# Altium schematic sheet PSU_NCP630_ADJ.SchDoc: PSU NCP630A ADJ
size A4; Organization: Altium Limited.; Address1: Level 3, 12a Rodborough Rd; Address2: Frenchs Forest 2086; Address3: NSW; Address4: AUSTRALIA; DocumentNumber: 40; SheetNumber: 41; SheetTotal: 106
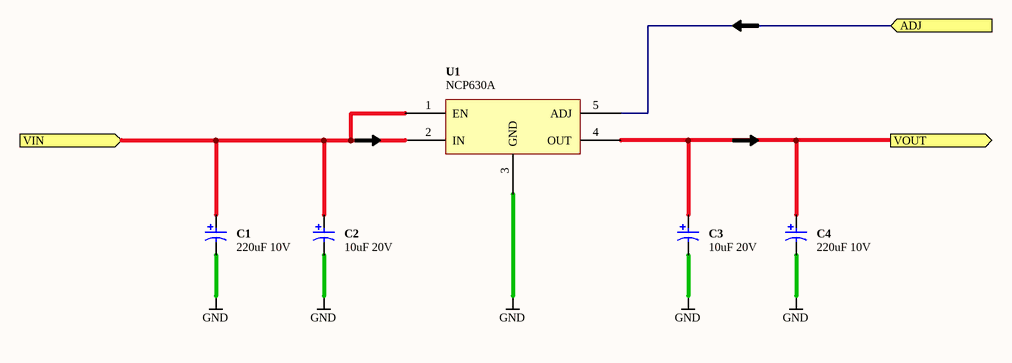
[diagram p0: PSU_NCP630_ADJ.SchDoc]

## Parts
C1  220uF 10V  [CAPC7343-STAR]
C2  10uF 20V  [CAPC3528-STAR]
C3  10uF 20V  [CAPC3528-STAR]
C4  220uF 10V  [CAPC7343-STAR]
U1  NCP630A  [TO-263-2]

## Ports
ADJ (in), VIN (in), VOUT (out)

## Nets
GND: C1.2 C2.2 C3.2 C4.2 U1.3(GND)
ADJ: U1.5(ADJ) ; port ADJ
VIN: C1.1 C2.1 U1.1(EN) U1.2(IN) ; port VIN
VOUT: C3.1 C4.1 U1.4(OUT) ; port VOUT

## Notes on the sheet
- Sheet Title
- Project Title
- Size:
- Date:
- A4
- Assy:
- Time:
- Revision:
- Sheet
- of
- File:

## Library data of the parts
C1 C4 = D-101-0088: Capacitor, Tantalum, 220uF 10% 10V MCCT-D (7343-31); Polarity: Polarized; Category: Capacitor; Capacitance: 220 uF; Mounting Technology: Surface Mount; Rated Voltage: 10 V; Status: Unreleased; Technology: Tantalum; Tolerance: 10 %
C2 C3 = D-101-0007: Capacitor, Tantalum, 10uF 10% 20V MCCT-B (3528); Polarity: Polarized; Category: Capacitor; Capacitance: 10 uF; Mounting Technology: Surface Mount; Rated Voltage: 20 V; Status: Production; Technology: Tantalum; Tolerance: 10 %
U1 = D-204-0034: NCP630A, 3.0A Fast Linear Voltage Regulator, D2PAK; Max Input Voltage: 12 V; Max Output Current: 3 (6.0 peak) A; Max Output Voltage: mV; Category: IC-Power; Min Input Voltage: mV; Min Output Voltage: mV; Mounting Technology: Surface Mount; Status: Unreleased; Supply Voltage: mV; Temperature Range: -40 to +125 degC